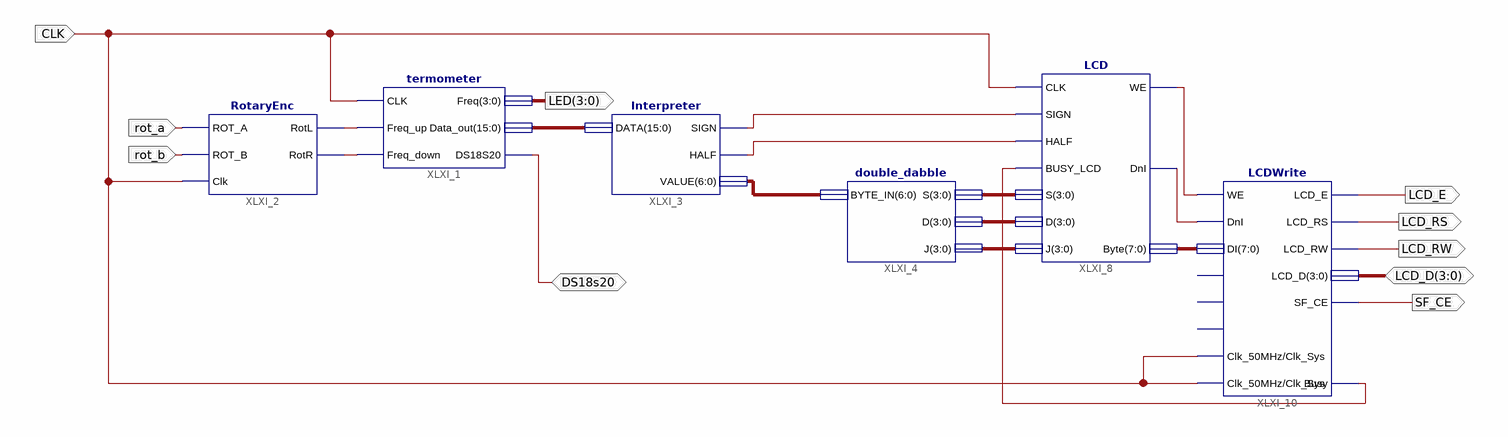
[diagram p0: schematic sheet 1]
// Xilinx ISE schematic final.sch (spartan3e) as structural Verilog: 6 symbols, 10 ports
module \final  (
  input  CLK,
  input  rot_a,
  input  rot_b,
  inout  [3:0] LCD_D,
  inout  DS18s20,
  output [3:0] LED,
  output LCD_E,
  output LCD_RS,
  output LCD_RW,
  output SF_CE
);

  wire XLXN_2, XLXN_3, XLXN_20, XLXN_21, XLXN_28, XLXN_29, XLXN_36;
  wire [3:0] XLXN_22, XLXN_23, XLXN_24;
  wire [6:0] XLXN_16;
  wire [7:0] XLXN_27;
  wire [15:0] XLXN_8;

  double_dabble XLXI_4 (.BYTE_IN(XLXN_16), .D(XLXN_22), .S(XLXN_23), .J(XLXN_24));
  termometer XLXI_1 (.CLK(CLK), .Freq_up(XLXN_2), .Freq_down(XLXN_3), .Freq(LED), .Data_out(XLXN_8), .DS18S20(DS18s20));
  RotaryEnc XLXI_2 (.ROT_A(rot_a), .ROT_B(rot_b), .RotL(XLXN_2), .RotR(XLXN_3), .Clk(CLK));
  Interpreter XLXI_3 (.DATA(XLXN_8), .VALUE(XLXN_16), .HALF(XLXN_21), .SIGN(XLXN_20));
  LCD XLXI_8 (
    .CLK(CLK), .SIGN(XLXN_20), .HALF(XLXN_21), .BUSY_LCD(XLXN_36), .S(XLXN_23), .D(XLXN_22), .J(XLXN_24),
    .WE(XLXN_29), .DnI(XLXN_28), .Byte(XLXN_27));
  LCDWrite XLXI_10 (
    .WE(XLXN_29), .DnI(XLXN_28), .DI(XLXN_27), .LCD_E(LCD_E), .LCD_RS(LCD_RS), .LCD_RW(LCD_RW),
    .LCD_D(LCD_D), .SF_CE(SF_CE), .Busy(XLXN_36), .Clk_50MHz(CLK), .Clk_Sys(CLK));  // open: Reset, Cursor, Blink
endmodule
